# EAGLE design warmwhite_strip_x5 (EAGLE 6.6.0)
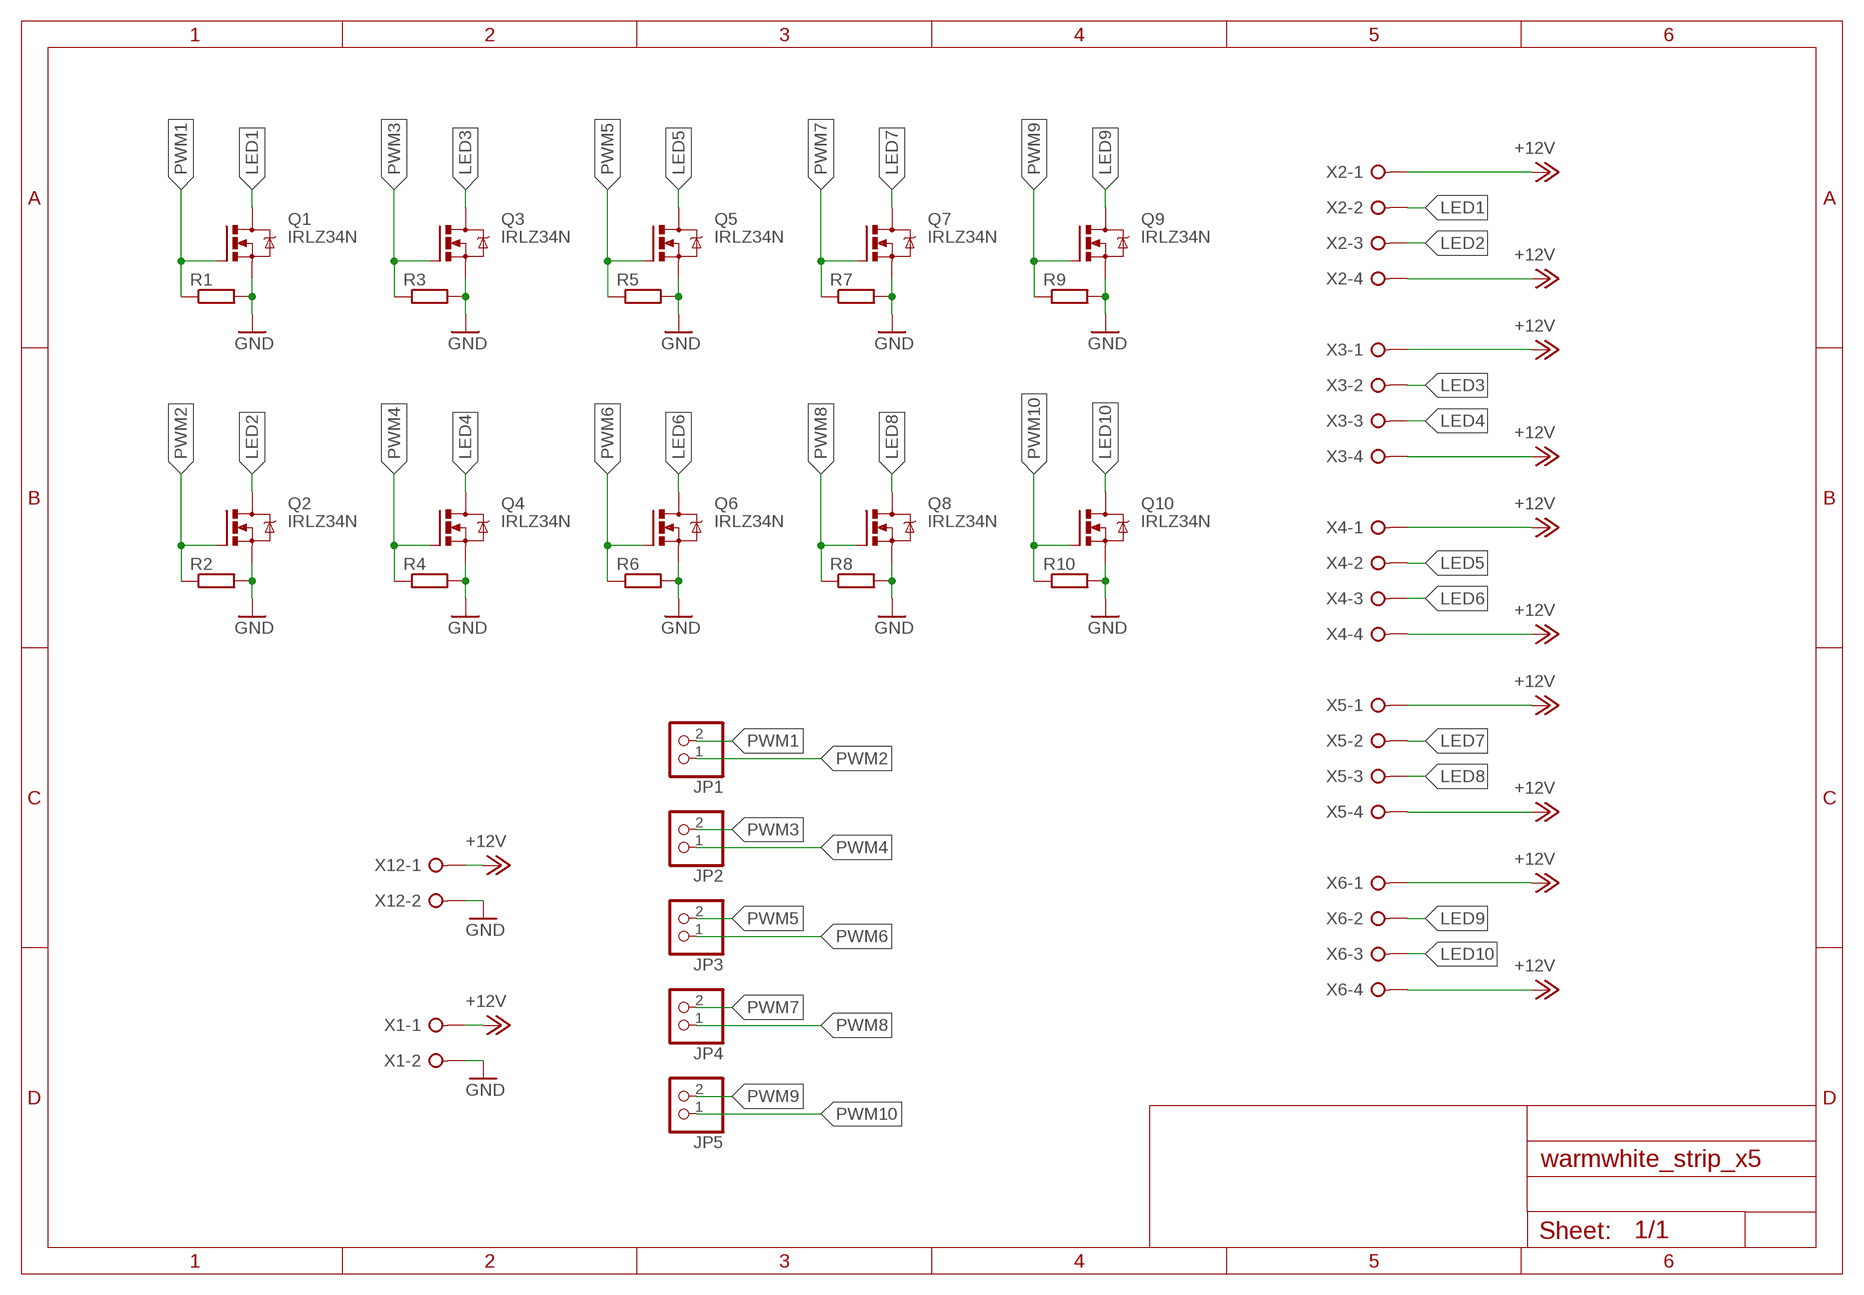
[diagram p0: schematic, sheet 1]

## Parts
JP1  PINHD-1X2  [1X02]
JP2  PINHD-1X2  [1X02]
JP3  PINHD-1X2  [1X02]
JP4  PINHD-1X2  [1X02]
JP5  PINHD-1X2  [1X02]
Q1  IRLZ34N  IRLZ44ZTO220BV  [TO220BV]
Q2  IRLZ34N  IRLZ44ZTO220BV  [TO220BV]
Q3  IRLZ34N  IRLZ44ZTO220BV  [TO220BV]
Q4  IRLZ34N  IRLZ44ZTO220BV  [TO220BV]
Q5  IRLZ34N  IRLZ44ZTO220BV  [TO220BV]
Q6  IRLZ34N  IRLZ44ZTO220BV  [TO220BV]
Q7  IRLZ34N  IRLZ44ZTO220BV  [TO220BV]
Q8  IRLZ34N  IRLZ44ZTO220BV  [TO220BV]
Q9  IRLZ34N  IRLZ44ZTO220BV  [TO220BV]
Q10  IRLZ34N  IRLZ44ZTO220BV  [TO220BV]
R1  R-EU_0207/10  [0207/10]
R2  R-EU_0207/10  [0207/10]
R3  R-EU_0207/10  [0207/10]
R4  R-EU_0207/10  [0207/10]
R5  R-EU_0207/10  [0207/10]
R6  R-EU_0207/10  [0207/10]
R7  R-EU_0207/10  [0207/10]
R8  R-EU_0207/10  [0207/10]
R9  R-EU_0207/10  [0207/10]
R10  R-EU_0207/10  [0207/10]
X1  W237-02P  [W237-132]
X2  W237-04P  [W237-4P]
X3  W237-04P  [W237-4P]
X4  W237-04P  [W237-4P]
X5  W237-04P  [W237-4P]
X6  W237-04P  [W237-4P]
X12  W237-02P  [W237-132]

## Nets
+12V: X1.1 X2.1 X2.4 X3.1 X3.4 X4.1 X4.4 X5.1 X5.4 X6.1 X6.4 X12.1
GND: Q1.S Q2.S Q3.S Q4.S Q5.S Q6.S Q7.S Q8.S Q9.S Q10.S R1.2 R2.2 R3.2 R4.2 R5.2 R6.2 R7.2 R8.2 R9.2 R10.2 X1.2 X12.2
LED1: Q1.D X2.2
LED2: Q2.D X2.3
LED3: Q3.D X3.2
LED4: Q4.D X3.3
LED5: Q5.D X4.2
LED6: Q6.D X4.3
LED7: Q7.D X5.2
LED8: Q8.D X5.3
LED9: Q9.D X6.2
LED10: Q10.D X6.3
PWM1: JP1.2 Q1.G R1.1
PWM2: JP1.1 Q2.G R2.1
PWM3: JP2.2 Q3.G R3.1
PWM4: JP2.1 Q4.G R4.1
PWM5: JP3.2 Q5.G R5.1
PWM6: JP3.1 Q6.G R6.1
PWM7: JP4.2 Q7.G R7.1
PWM8: JP4.1 Q8.G R8.1
PWM9: JP5.2 Q9.G R9.1
PWM10: JP5.1 Q10.G R10.1

## Library data of the parts
JP1-JP5 = pinhead:PINHD-1X2: PIN HEADER
Q1-Q10 = transistor-power:IRLZ44Z: N-Channel HEXFET® Power MOSFET Logic Level AUTOMOTIVE MOSFET Source: http://www.irf.com/product-info/datasheets/data/irlz44zpbf.pdf
R1-R10 = resistor:R-EU_: RESISTOR, European symbol
X1 X12 = con-wago-508:W237-02P: WAGO SREW CLAMP; OC_FARNELL: unknown; OC_NEWARK: unknown
X2-X6 = con-wago-508:W237-04P: WAGO SREW CLAMP; OC_FARNELL: unknown; OC_NEWARK: unknown

## Board
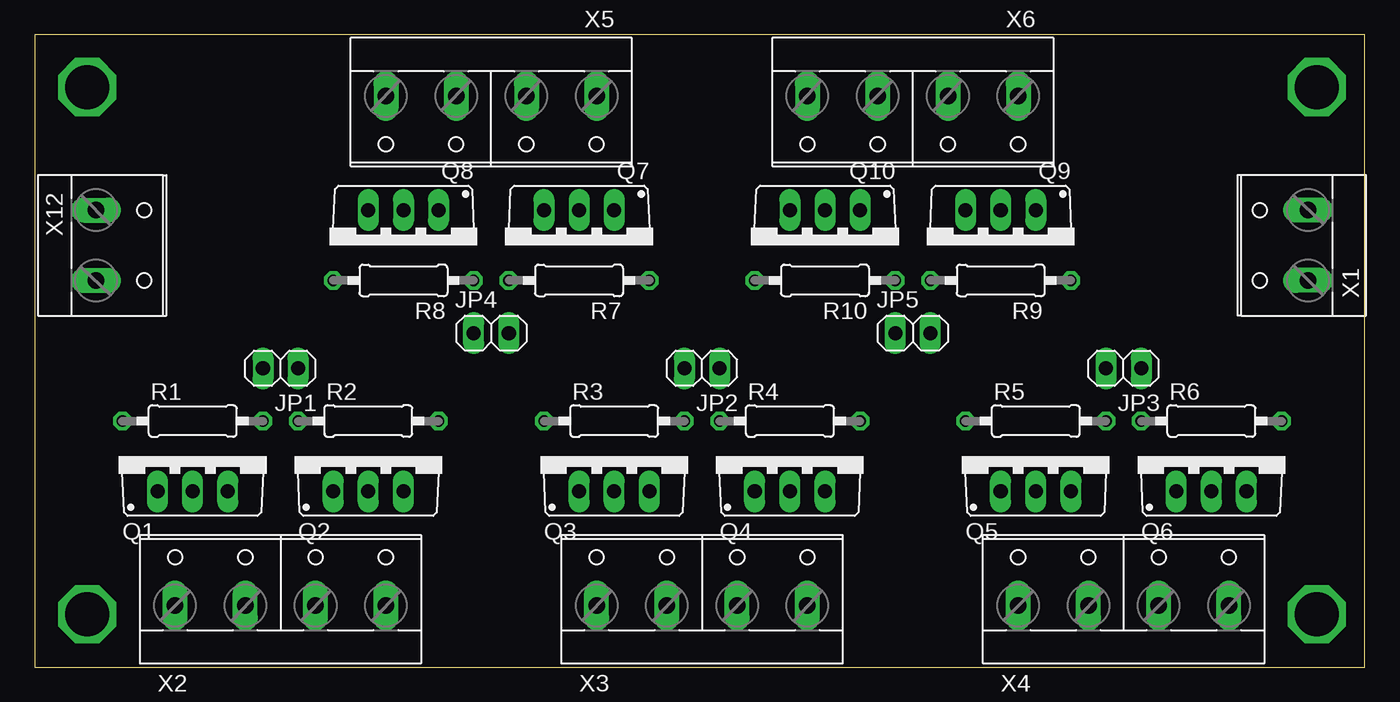
[diagram p1: board, top side]
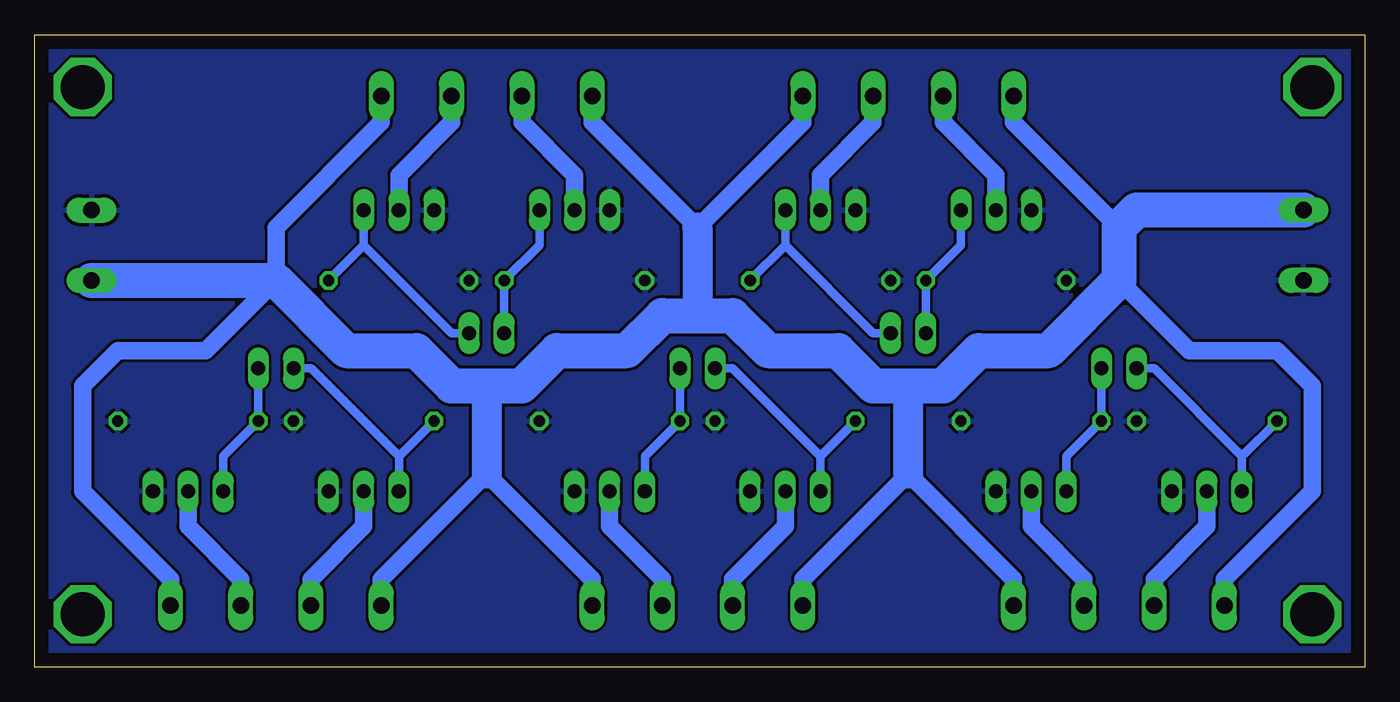
[diagram p2: board, bottom side, seen from below]

Size 96.19 x 45.71 mm. Coordinates in mm from the lower left corner, seen from the top.
Outline: 0,0 96.19,0 96.19,45.71 0,45.71 0,0
Copper layers (1*16): Top 0.035mm / dielectric 1.5mm / Bottom 0.035mm
Design rules "default": minimum track width 10mil, minimum drill 24mil, track to track 8mil, track to pad 8mil, pad to pad 8mil, via to via 8mil, smd to smd 8mil, copper to edge 40mil, drill to drill 8mil, minimum pad ring 10mil, minimum via ring 8mil, stop-mask expansion 4mil, vias tented up to drill 0mil, thermal gap 10mil

### Footprints (pad centres in the part's own frame; a part is rotated, then mirrored left to right if it is on the bottom)
1X02 = drill 1.016 long: 1 -1.27,0; 2 1.27,0
TO220BV = drill 1.016 long: D 0,-2.54; G -2.54,-2.54; S 2.54,-2.54
0207/10 = drill 0.813 octagon: 1 -5.08,0; 2 5.08,0
W237-132 = drill 1.194 long: 1 -2.54,-0.635; 2 2.54,-0.635
W237-4P = drill 1.194 long: 1 -7.62,-0.635; 2 -2.54,-0.635; 3 2.54,-0.635; 4 7.62,-0.635

### Placement (x,y rotation side)
JP1  17.78,21.59 180 top
JP2  48.26,21.59 180 top
JP3  78.74,21.59 180 top
JP4  33.02,24.13 0 top
JP5  63.5,24.13 0 top
Q1  11.43,15.24 0 top
Q2  24.13,15.24 0 top
Q3  41.91,15.24 0 top
Q4  54.61,15.24 0 top
Q5  72.39,15.24 0 top
Q6  85.09,15.24 0 top
Q7  39.37,30.48 180 top
Q8  26.67,30.48 180 top
Q9  69.85,30.48 180 top
Q10  57.15,30.48 180 top
R1  11.43,17.78 0 top
R2  24.13,17.78 0 top
R3  41.91,17.78 0 top
R4  54.61,17.78 0 top
R5  72.39,17.78 0 top
R6  85.09,17.78 0 top
R7  39.37,27.94 180 top
R8  26.67,27.94 180 top
R9  69.85,27.94 180 top
R10  57.15,27.94 180 top
X1  91.44,30.48 90 top
X2  17.78,5.08 0 top
X3  48.26,5.08 0 top
X4  78.74,5.08 0 top
X5  33.02,40.64 180 top
X6  63.5,40.64 180 top
X12  5.08,30.48 270 top

### Tracks (layer width: path | path; a pad name or v marks a point on that pad's centre or on a via)
+12V
  Bottom 1.27: X2.4 25.4,6.35 33.02,13.97 40.64,6.35 X3.1 | X2.1 10.16,6.35 3.81,12.7 3.81,20.32 6.35,22.86 12.7,22.86 17.78,27.94 | X5.4 25.4,39.37 17.78,31.75 | X3.4 55.88,6.35 63.5,13.97 71.12,6.35 X4.1 | X5.1 40.64,39.37 48.26,31.75 55.88,39.37 X6.4 | X6.1 71.12,39.37 78.74,31.75 78.74,27.94 83.82,22.86 90.17,22.86 92.71,20.32 92.71,12.7 86.36,6.35 X4.4
  Bottom 2.184: 33.02,13.97 33.02,20.32 | 48.26,31.75 48.26,25.4 | 63.5,20.32 63.5,13.97
  Bottom 2.54: X1.1 78.74,27.94 73.66,22.86 68.58,22.86 66.04,20.32 63.5,20.32 60.96,20.32 58.42,22.86 53.34,22.86 50.8,25.4 48.26,25.4 45.72,25.4 43.18,22.86 38.1,22.86 35.56,20.32 33.02,20.32 30.48,20.32 27.94,22.86 22.86,22.86 17.78,27.94 17.78,31.75 16.51,33.02 X12.1
GND
  pour Bottom: 0,45.72 96.52,45.72 96.52,0 0,0
LED1
  Bottom 1.27: Q1.D 11.43,10.16 15.24,6.35 X2.2
LED2
  Bottom 1.27: Q2.D 24.13,10.16 20.32,6.35 X2.3
LED3
  Bottom 1.27: Q3.D 41.91,10.16 45.72,6.35 X3.2
LED4
  Bottom 1.27: Q4.D 54.61,10.16 50.8,6.35 X3.3
LED5
  Bottom 1.27: Q5.D 72.39,10.16 76.2,6.35 X4.2
LED6
  Bottom 1.27: Q6.D 85.09,10.16 81.28,6.35 X4.3
LED7
  Bottom 1.27: X5.2 35.56,39.37 39.37,35.56 Q7.D
LED8
  Bottom 1.27: Q8.D 26.67,35.56 30.48,39.37 X5.3
LED9
  Bottom 1.27: X6.2 66.04,39.37 69.85,35.56 Q9.D
LED10
  Bottom 1.27: X6.3 60.96,39.37 57.15,35.56 Q10.D
N$1  (via drill 3.2)
  other vias: 3.81,3.81
N$2  (via drill 3.2)
  other vias: 92.71,3.81
N$3  (via drill 3.2)
  other vias: 3.81,41.91
N$4  (via drill 3.2)
  other vias: 92.71,41.91
PWM1
  Bottom 0.61: JP1.2 15.24,21.59 8.89,15.24 | 8.89,15.24 Q1.G | 8.89,15.24 R1.1
PWM2
  Bottom 0.61: JP1.1 R2.1 21.59,15.24 Q2.G
PWM3
  Bottom 0.61: JP2.2 45.72,21.59 39.37,15.24 | 39.37,15.24 Q3.G | R3.1 39.37,15.24
PWM4
  Bottom 0.61: JP2.1 R4.1 52.07,15.24 Q4.G
PWM5
  Bottom 0.61: JP3.2 76.2,21.59 69.85,15.24 | 69.85,15.24 Q5.G | R5.1 69.85,15.24
PWM6
  Bottom 0.61: JP3.1 R6.1 82.55,15.24 Q6.G
PWM7
  Bottom 0.61: JP4.2 35.56,24.13 41.91,30.48 | 41.91,30.48 Q7.G | R7.1 41.91,30.48
PWM8
  Bottom 0.61: JP4.1 R8.1 29.21,30.48 Q8.G
PWM9
  Bottom 0.61: JP5.2 66.04,24.13 72.39,30.48 | 72.39,30.48 Q9.G | R9.1 72.39,30.48
PWM10
  Bottom 0.61: JP5.1 R10.1 59.69,30.48 Q10.G